# Altium schematic sheet main.SchDoc: SSLMainPCB VIII
size A
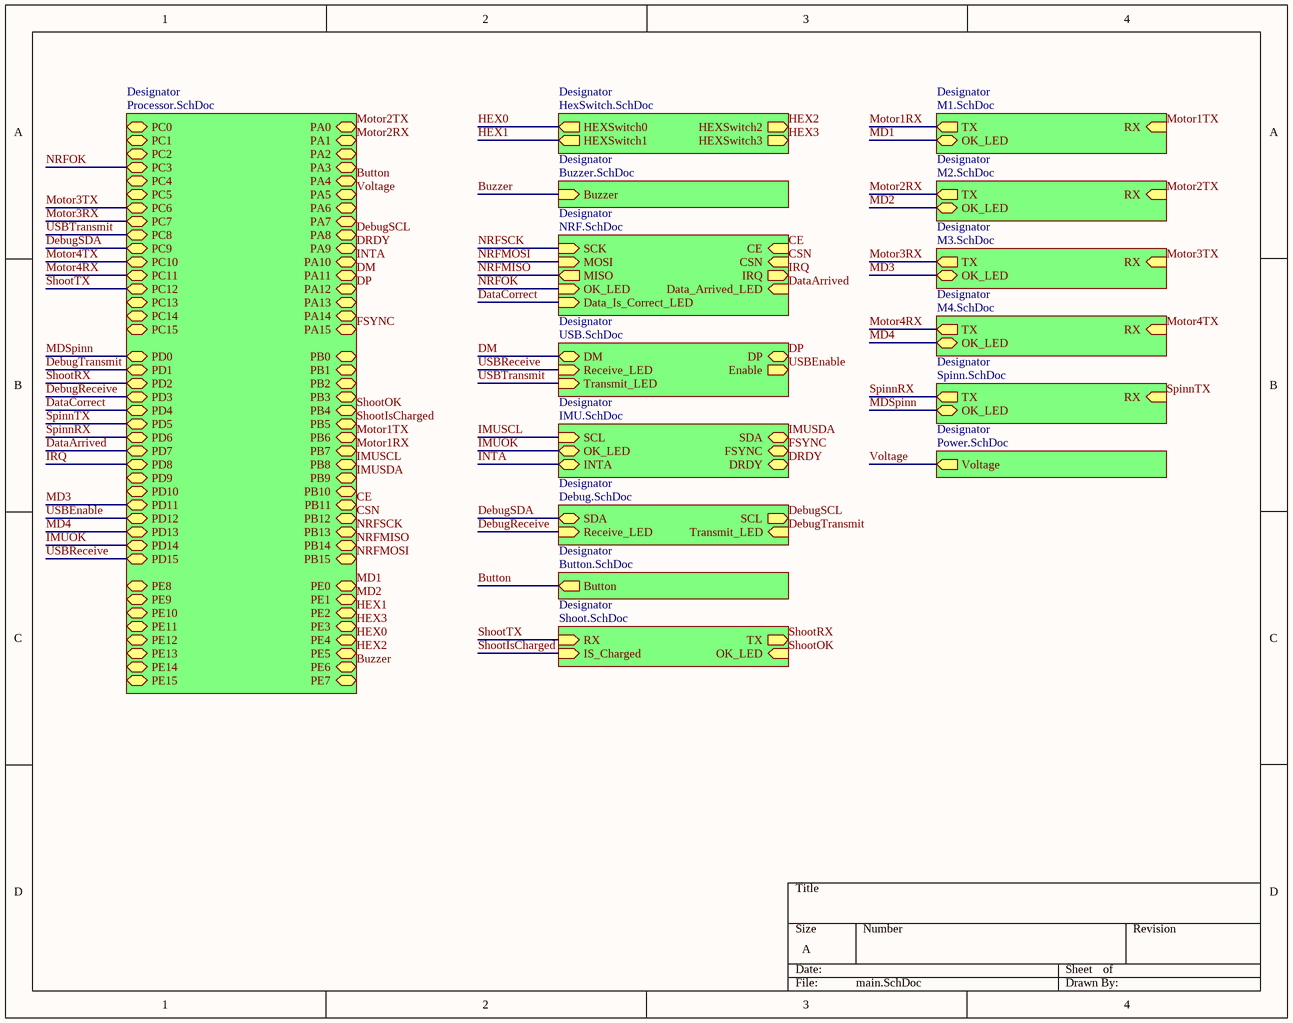
[diagram p0: main.SchDoc]

## Sub-sheets
Designator = Processor.SchDoc: PA0 (bidir), PA1 (bidir), PA2 (bidir), PA3 (bidir), PA4 (bidir), PA5 (bidir), PA6 (bidir), PA7 (bidir), PA8 (bidir), PA9 (bidir), PA10 (bidir), PA11 (bidir), PA12 (bidir), PA13 (bidir), PA14 (bidir), PA15 (bidir), PB0 (bidir), PB1 (bidir), PB2 (bidir), PB3 (bidir), PB4 (bidir), PB5 (bidir), PB6 (bidir), PB7 (bidir), PB8 (bidir), PB9 (bidir), PB10 (bidir), PB11 (bidir), PB12 (bidir), PB13 (bidir), PB14 (bidir), PB15 (bidir), PC0 (bidir), PC1 (bidir), PC2 (bidir), PC3 (bidir), PC4 (bidir), PC5 (bidir), PC6 (bidir), PC7 (bidir), PC8 (bidir), PC9 (bidir), PC10 (bidir), PC11 (bidir), PC12 (bidir), PC13 (bidir), PC14 (bidir), PC15 (bidir), PD0 (bidir), PD1 (bidir), PD2 (bidir), PD3 (bidir), PD4 (bidir), PD5 (bidir), PD6 (bidir), PD7 (bidir), PD8 (bidir), PD9 (bidir), PD10 (bidir), PD11 (bidir), PD12 (bidir), PD13 (bidir), PD14 (bidir), PD15 (bidir), PE1 (bidir), PE2 (bidir), PE3 (bidir), PE4 (bidir), PE5 (bidir), PE6 (bidir), PE7 (bidir), PE8 (bidir), PE9 (bidir), PE10 (bidir), PE11 (bidir), PE12 (bidir), PE13 (bidir), PE14 (bidir), PE15 (bidir), PE0 (bidir)
Designator = HexSwitch.SchDoc: HEXSwitch0 (out), HEXSwitch1 (out), HEXSwitch2 (out), HEXSwitch3 (out)
Designator = Buzzer.SchDoc: Buzzer (in)
Designator = NRF.SchDoc: SCK (in), MOSI (in), MISO (out), CE (in), CSN (in), IRQ (out), OK_LED (in), Data_Is_Correct_LED (in), Data_Arrived_LED (in)
Designator = USB.SchDoc: DM (bidir), DP (bidir), Receive_LED (in), Transmit_LED (in), Enable (out)
Designator = IMU.SchDoc: SCL (in), SDA, OK_LED, INTA, FSYNC, DRDY
Designator = Button.SchDoc: Button (out)
Designator = Debug.SchDoc: SDA (bidir), SCL (out), Receive_LED (in), Transmit_LED (in)
Designator = Shoot.SchDoc: RX (in), IS_Charged (in), TX (out), OK_LED (in)
Designator = M1.SchDoc: TX (out), OK_LED, RX (in)
Designator = M2.SchDoc: TX (out), OK_LED, RX (in)
Designator = M3.SchDoc: TX (out), OK_LED, RX (in)
Designator = M4.SchDoc: TX (out), OK_LED, RX (in)
Designator = Spinn.SchDoc: TX (out), OK_LED, RX (in)
Designator = Power.SchDoc: Voltage (out)

## Nets
Button: sheet Designator/PA4, sheet Designator/Button
Buzzer: sheet Designator/PE6, sheet Designator/Buzzer
CE: sheet Designator/PB11, sheet Designator/CE
CSN: sheet Designator/PB12, sheet Designator/CSN
DataArrived: sheet Designator/PD7, sheet Designator/Data_Arrived_LED
DataCorrect: sheet Designator/PD4, sheet Designator/Data_Is_Correct_LED
DebugReceive: sheet Designator/PD3, sheet Designator/Receive_LED
DebugSCL: sheet Designator/PA8, sheet Designator/SCL
DebugSDA: sheet Designator/PC9, sheet Designator/SDA
DebugTransmit: sheet Designator/PD1, sheet Designator/Transmit_LED
DM: sheet Designator/PA11, sheet Designator/DM
DP: sheet Designator/PA12, sheet Designator/DP
DRDY: sheet Designator/PA9, sheet Designator/DRDY
FSYNC: sheet Designator/PA15, sheet Designator/FSYNC
HEX0: sheet Designator/PE4, sheet Designator/HEXSwitch0
HEX1: sheet Designator/PE2, sheet Designator/HEXSwitch1
HEX2: sheet Designator/PE5, sheet Designator/HEXSwitch2
HEX3: sheet Designator/PE3, sheet Designator/HEXSwitch3
IMUOK: sheet Designator/PD14, sheet Designator/OK_LED
IMUSCL: sheet Designator/PB8, sheet Designator/SCL
IMUSDA: sheet Designator/PB9, sheet Designator/SDA
INTA: sheet Designator/PA10, sheet Designator/INTA
IRQ: sheet Designator/PD8, sheet Designator/IRQ
MD1: sheet Designator/PE0, sheet Designator/OK_LED
MD2: sheet Designator/PE1, sheet Designator/OK_LED
MD3: sheet Designator/PD11, sheet Designator/OK_LED
MD4: sheet Designator/PD13, sheet Designator/OK_LED
MDSpinn: sheet Designator/PD0, sheet Designator/OK_LED
Motor1RX: sheet Designator/PB7, sheet Designator/TX
Motor1TX: sheet Designator/PB6, sheet Designator/RX
Motor2RX: sheet Designator/PA1, sheet Designator/TX
Motor2TX: sheet Designator/PA0, sheet Designator/RX
Motor3RX: sheet Designator/PC7, sheet Designator/TX
Motor3TX: sheet Designator/PC6, sheet Designator/RX
Motor4RX: sheet Designator/PC11, sheet Designator/TX
Motor4TX: sheet Designator/PC10, sheet Designator/RX
NRFMISO: sheet Designator/PB14, sheet Designator/MISO
NRFMOSI: sheet Designator/PB15, sheet Designator/MOSI
NRFOK: sheet Designator/PC3, sheet Designator/OK_LED
NRFSCK: sheet Designator/PB13, sheet Designator/SCK
ShootIsCharged: sheet Designator/PB5, sheet Designator/IS_Charged
ShootOK: sheet Designator/PB4, sheet Designator/OK_LED
ShootRX: sheet Designator/PD2, sheet Designator/TX
ShootTX: sheet Designator/PC12, sheet Designator/RX
SpinnRX: sheet Designator/PD6, sheet Designator/TX
SpinnTX: sheet Designator/PD5, sheet Designator/RX
USBEnable: sheet Designator/PD12, sheet Designator/Enable
USBReceive: sheet Designator/PD15, sheet Designator/Receive_LED
USBTransmit: sheet Designator/PC8, sheet Designator/Transmit_LED
Voltage: sheet Designator/PA5, sheet Designator/Voltage